# EAGLE schematic rj11-breakout (EAGLE 6.5.0)
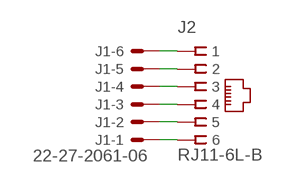
[diagram p0: schematic, sheet 1]

## Parts
J1  22-27-2061-06  [6410-06]
J2  RJ11-6L-B  [RJ11-NO_SHIELD]

## Nets
N$1: J1.1 J2.6
N$2: J1.2 J2.5
N$3: J1.3 J2.4
N$4: J1.4 J2.3
N$5: J1.5 J2.2
N$6: J1.6 J2.1

## Library data of the parts
J1 = con-molex:22-?-06: CONNECTOR wire to board 2.54 mm (.1 inch) pitch header; OC_FARNELL: unknown; OC_NEWARK: unknown
J2 = con-tycoelectronics:RJ11: CORCOM Modular RJ Jacks No Shield Source: www.tycoelectronics.com .. ENG_DS_1654001_1099_RJ_L_0507.pdf; MF: TYCO ELECTRONICS; MPN: RJ11-6L-B; OC_FARNELL: unknown; OC_NEWARK: 52K3613